# Altium schematic sheet Blank.SchDoc: Expansion_blank
size A4; DrawnBy: Cristian Oprea; Revision: 1; SheetNumber: 2; SheetTotal: 2
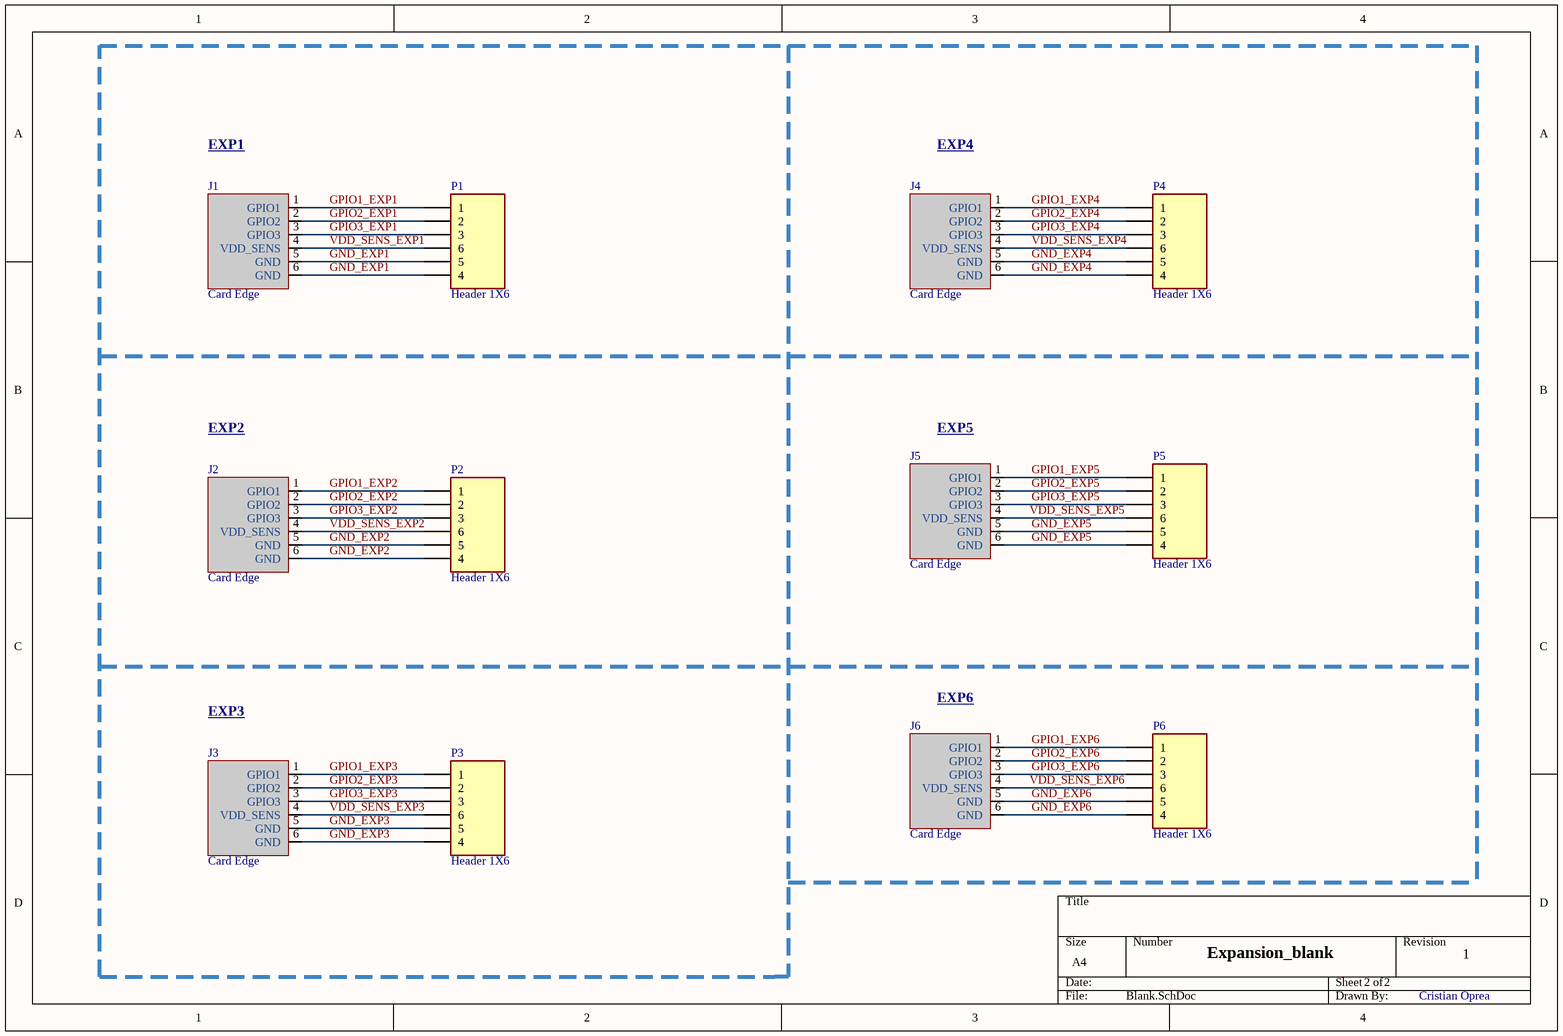
[diagram p0: Blank.SchDoc]

## Parts
J1  Card Edge  [Card Edge]
J2  Card Edge  [Card Edge]
J3  Card Edge  [Card Edge]
J4  Card Edge  [Card Edge]
J5  Card Edge  [Card Edge]
J6  Card Edge  [Card Edge]
P1  Header 1X6  [HDR2X32]
P2  Header 1X6  [HDR2X32]
P3  Header 1X6  [HDR2X32]
P4  Header 1X6  [HDR2X32]
P5  Header 1X6  [HDR2X32]
P6  Header 1X6  [HDR2X32]

## Nets
GND_EXP1: J1.5(GND) J1.6(GND) P1.4 P1.5
GND_EXP2: J2.5(GND) J2.6(GND) P2.4 P2.5
GND_EXP3: J3.5(GND) J3.6(GND) P3.4 P3.5
GND_EXP4: J4.5(GND) J4.6(GND) P4.4 P4.5
GND_EXP5: J5.5(GND) J5.6(GND) P5.4 P5.5
GND_EXP6: J6.5(GND) J6.6(GND) P6.4 P6.5
GPIO1_EXP1: J1.1(GPIO1) P1.1
GPIO1_EXP2: J2.1(GPIO1) P2.1
GPIO1_EXP3: J3.1(GPIO1) P3.1
GPIO1_EXP4: J4.1(GPIO1) P4.1
GPIO1_EXP5: J5.1(GPIO1) P5.1
GPIO1_EXP6: J6.1(GPIO1) P6.1
GPIO2_EXP1: J1.2(GPIO2) P1.2
GPIO2_EXP2: J2.2(GPIO2) P2.2
GPIO2_EXP3: J3.2(GPIO2) P3.2
GPIO2_EXP4: J4.2(GPIO2) P4.2
GPIO2_EXP5: J5.2(GPIO2) P5.2
GPIO2_EXP6: J6.2(GPIO2) P6.2
GPIO3_EXP1: J1.3(GPIO3) P1.3
GPIO3_EXP2: J2.3(GPIO3) P2.3
GPIO3_EXP3: J3.3(GPIO3) P3.3
GPIO3_EXP4: J4.3(GPIO3) P4.3
GPIO3_EXP5: J5.3(GPIO3) P5.3
GPIO3_EXP6: J6.3(GPIO3) P6.3
VDD_SENS_EXP1: J1.4(VDD_SENS) P1.6
VDD_SENS_EXP2: J2.4(VDD_SENS) P2.6
VDD_SENS_EXP3: J3.4(VDD_SENS) P3.6
VDD_SENS_EXP4: J4.4(VDD_SENS) P4.6
VDD_SENS_EXP5: J5.4(VDD_SENS) P5.6
VDD_SENS_EXP6: J6.4(VDD_SENS) P6.6

## Notes on the sheet
- EXP1
- EXP4
- EXP2
- (near J5) EXP5
- EXP3
- (near J6) EXP6

## Library data of the parts
J1-J6 = Card Edge: Card Edge pads for 2.54 mm pitch edge connector
P1-P6 = Header 1X6: Header,6-Pin, Single row; LatestRevisionDate: 17-Jul-2002; LatestRevisionNote: Re-released for DXP Platform.; Publisher: Altium Limited